# EAGLE design mega16-dev (EAGLE 5.07)
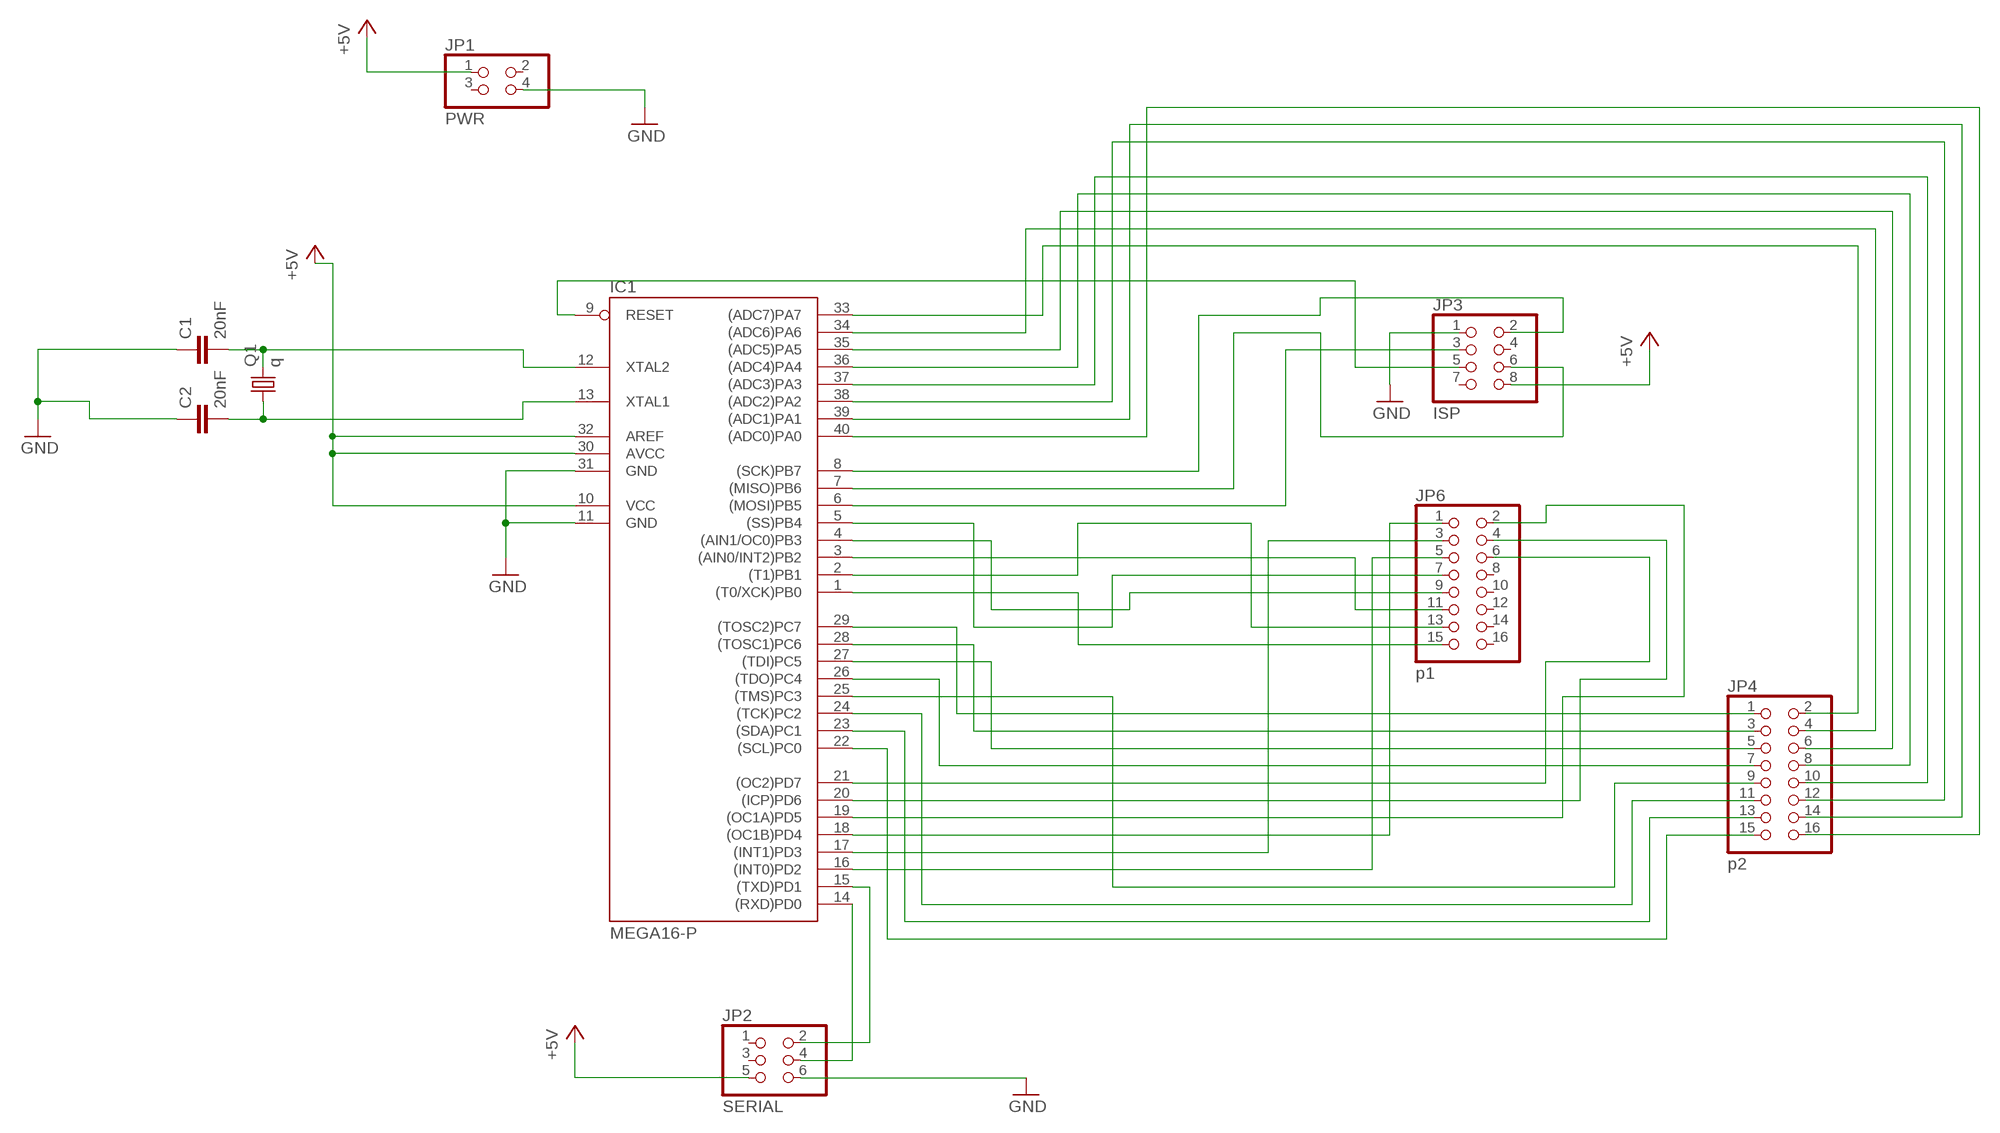
[diagram p0: schematic, sheet 1]

## Parts
C1  20nF  C-EU025-030X050  [C025-030X050]
C2  20nF  C-EU025-030X050  [C025-030X050]
IC1  MEGA16-P  [DIL40]
JP1  PWR  PINHD-2X2  [2X02]
JP2  SERIAL  PINHD-2X3  [2X03]
JP3  ISP  PINHD-2X4  [2X04]
JP4  p2  PINHD-2X8  [2X08]
JP6  p1  PINHD-2X8  [2X08]
Q1  q  CRYSTALHC18U-V  [HC18U-V]

## Nets
+5V: IC1.10(VCC) IC1.30(AVCC) IC1.32(AREF) JP1.1 JP2.5 JP3.8
GND: C1.1 C2.1 IC1.11(GND) IC1.31(GND) JP1.4 JP2.6 JP3.1
N$1: C1.2 IC1.12(XTAL2) Q1.2
N$2: C2.2 IC1.13(XTAL1) Q1.1
N$3: IC1.15((TXD)PD1) JP2.2
N$4: IC1.6((MOSI)PB5) JP3.3
N$5: IC1.14((RXD)PD0) JP2.4
N$6: IC1.9(RESET) JP3.5
N$7: IC1.8((SCK)PB7) JP3.2
N$8: IC1.7((MISO)PB6) JP3.6
N$9: IC1.18((OC1B)PD4) JP6.1
N$10: IC1.17((INT1)PD3) JP6.3
N$11: IC1.16((INT0)PD2) JP6.5
N$12: IC1.4((AIN1/OC0)PB3) JP6.9
N$13: IC1.5((SS)PB4) JP6.7
N$14: IC1.3((AIN0/INT2)PB2) JP6.11
N$15: IC1.2((T1)PB1) JP6.13
N$16: IC1.1((T0/XCK)PB0) JP6.15
N$17: IC1.19((OC1A)PD5) JP6.2
N$18: IC1.20((ICP)PD6) JP6.4
N$19: IC1.21((OC2)PD7) JP6.6
N$20: IC1.33((ADC7)PA7) JP4.2
N$21: IC1.34((ADC6)PA6) JP4.4
N$22: IC1.35((ADC5)PA5) JP4.6
N$23: IC1.36((ADC4)PA4) JP4.8
N$24: IC1.37((ADC3)PA3) JP4.10
N$25: IC1.38((ADC2)PA2) JP4.12
N$26: IC1.39((ADC1)PA1) JP4.14
N$27: IC1.40((ADC0)PA0) JP4.16
N$28: IC1.29((TOSC2)PC7) JP4.1
N$29: IC1.28((TOSC1)PC6) JP4.3
N$30: IC1.27((TDI)PC5) JP4.5
N$31: IC1.26((TDO)PC4) JP4.7
N$32: IC1.25((TMS)PC3) JP4.9
N$33: IC1.24((TCK)PC2) JP4.11
N$34: IC1.23((SDA)PC1) JP4.13
N$35: IC1.22((SCL)PC0) JP4.15
Unconnected: JP1.2 JP1.3 JP2.1 JP2.3 JP3.4 JP3.7 JP6.8 JP6.10 JP6.12 JP6.14 JP6.16

## Library data of the parts
C1 C2 = rcl:C-EU: CAPACITOR, European symbol
IC1 = atmel:MEGA16-P: MICROCONTROLLER 16 Kbytes FLASH 1 kbytes SRAM 512 bytes EEPROM USART 8-channel 10 bit ADC Source: avr.lbr
JP1 = pinhead:PINHD-2X2: PIN HEADER
JP2 = pinhead:PINHD-2X3: PIN HEADER
JP3 = pinhead:PINHD-2X4: PIN HEADER
JP4 JP6 = pinhead:PINHD-2X8: PIN HEADER
Q1 = crystal:CRYSTAL: CRYSTAL

## Board
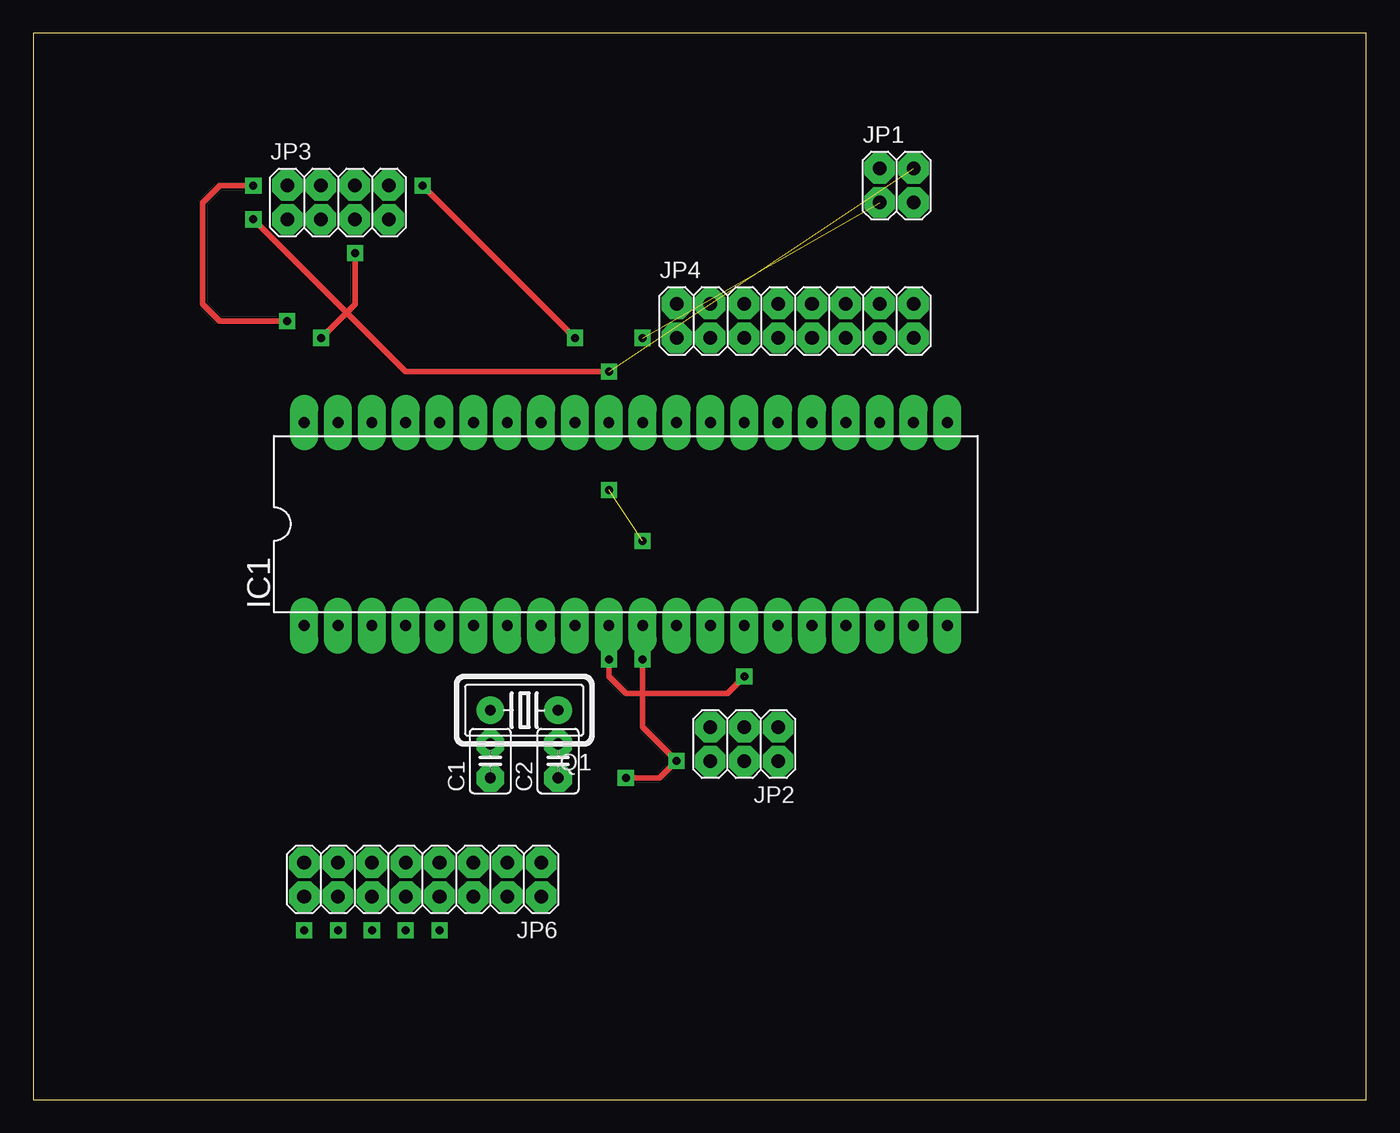
[diagram p1: board, top side]
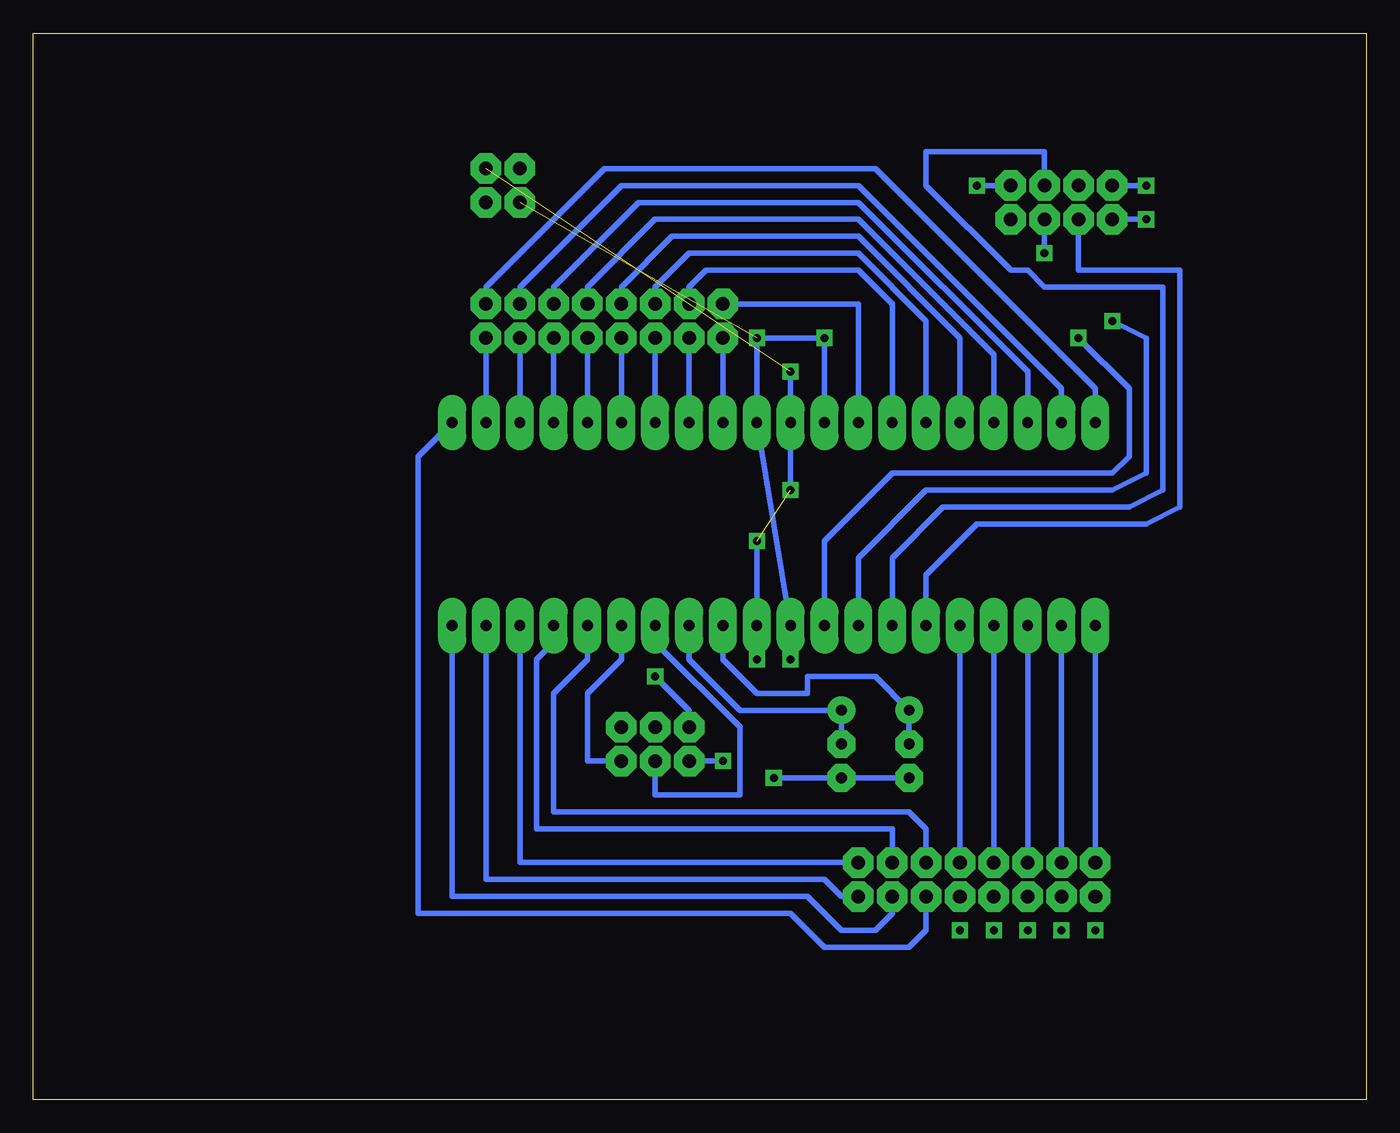
[diagram p2: board, bottom side, seen from below]

Size 100 x 80 mm. Coordinates in mm from the lower left corner, seen from the top.
Outline: 0,0 100,0 100,80 0,80 0,0
Copper layers (1*16): Top 0.035mm / dielectric 1.5mm / Bottom 0.035mm
Design rules "default": minimum track width 10mil, minimum drill 32mil, track to track 12mil, track to pad 12mil, pad to pad 12mil, via to via 12mil, smd to smd 8mil, copper to edge 40mil, drill to drill 40mil, minimum pad ring 25mil, minimum via ring 12mil, stop-mask expansion 4mil, vias tented up to drill 0mil, thermal gap 10mil

### Footprints (pad centres in the part's own frame; a part is rotated, then mirrored left to right if it is on the bottom)
C025-030X050 = drill 0.813 octagon: 1 -1.27,0; 2 1.27,0
DIL40 = drill 0.813 long: 1 -24.13,-7.62; 2 -21.59,-7.62; 3 -19.05,-7.62; 4 -16.51,-7.62; 5 -13.97,-7.62; 6 -11.43,-7.62; 7 -8.89,-7.62; 8 -6.35,-7.62; 9 -3.81,-7.62; 10 -1.27,-7.62; 11 1.27,-7.62; 12 3.81,-7.62; 13 6.35,-7.62; 14 8.89,-7.62; 15 11.43,-7.62; 16 13.97,-7.62; 17 16.51,-7.62; 18 19.05,-7.62; 19 21.59,-7.62; 20 24.13,-7.62; 21 24.13,7.62; 22 21.59,7.62; 23 19.05,7.62; 24 16.51,7.62; 25 13.97,7.62; 26 11.43,7.62; 27 8.89,7.62; 28 6.35,7.62; 29 3.81,7.62; 30 1.27,7.62; 31 -1.27,7.62; 32 -3.81,7.62; 33 -6.35,7.62; 34 -8.89,7.62; 35 -11.43,7.62; 36 -13.97,7.62; 37 -16.51,7.62; 38 -19.05,7.62; 39 -21.59,7.62; 40 -24.13,7.62
2X02 = drill 1.016 octagon: 1 -1.27,-1.27; 2 -1.27,1.27; 3 1.27,-1.27; 4 1.27,1.27
2X03 = drill 1.016 octagon: 1 -2.54,-1.27; 2 -2.54,1.27; 3 0,-1.27; 4 0,1.27; 5 2.54,-1.27; 6 2.54,1.27
2X04 = drill 1.016 octagon: 1 -3.81,-1.27; 2 -3.81,1.27; 3 -1.27,-1.27; 4 -1.27,1.27; 5 1.27,-1.27; 6 1.27,1.27; 7 3.81,-1.27; 8 3.81,1.27
2X08 = drill 1.016 octagon: 1 -8.89,-1.27; 2 -8.89,1.27; 3 -6.35,-1.27; 4 -6.35,1.27; 5 -3.81,-1.27; 6 -3.81,1.27; 7 -1.27,-1.27; 8 -1.27,1.27; 9 1.27,-1.27; 10 1.27,1.27; 11 3.81,-1.27; 12 3.81,1.27; 13 6.35,-1.27; 14 6.35,1.27; 15 8.89,-1.27; 16 8.89,1.27
HC18U-V = drill 0.813 round: 1 -2.54,0; 2 2.54,0

### Placement (x,y rotation side)
C1  34.29,25.4 90 top
C2  39.37,25.4 90 top
IC1  44.45,43.18 0 top
JP1  64.77,68.58 0 top
JP2  53.34,26.67 180 top
JP3  22.86,67.31 0 top
JP4  57.15,58.42 0 top
JP6  29.21,16.51 180 top
Q1  36.83,29.21 180 top

### Tracks (layer width: path | path; a pad name or v marks a point on that pad's centre or on a via)
+5V  (via drill 0.6)  (3 unrouted)
  Top 0.406: v29.21,68.58 40.64,57.15 | v43.18,33.02 43.18,31.75 44.45,30.48 52.07,30.48 53.34,31.75
  Bottom 0.406: IC1.32 40.64,57.15 45.72,57.15 IC1.30 IC1.10 v43.18,33.02 | JP3.8 v29.21,68.58 | JP2.5 50.8,29.21 53.34,31.75
GND  (via drill 0.6)  (4 unrouted)
  Top 0.406: v43.18,54.61 27.94,54.61 16.51,66.04 | v44.45,24.13 46.99,24.13 48.26,25.4 45.72,27.94 v45.72,33.02
  Bottom 0.406: v43.18,54.61 IC1.31 43.18,45.72 | 16.51,66.04 JP3.1 | C1.1 C2.1 v44.45,24.13 | 48.26,25.4 JP2.6 | 45.72,41.91 IC1.11 v45.72,33.02
N$1
  Bottom 0.406: C1.2 Q1.2 36.83,31.75 41.91,31.75 41.91,30.48 45.72,30.48 48.26,33.02 IC1.12
N$2
  Bottom 0.406: IC1.13 50.8,33.02 46.99,29.21 Q1.1 C2.2
N$3
  Bottom 0.406: IC1.15 55.88,33.02 58.42,30.48 58.42,25.4 JP2.2
N$4
  Bottom 0.406: IC1.6 33.02,39.37 29.21,43.18 16.51,43.18 13.97,44.45 13.97,62.23 21.59,62.23 JP3.3
N$5
  Bottom 0.406: IC1.14 53.34,34.29 46.99,27.94 46.99,22.86 53.34,22.86 JP2.4
N$6  (via drill 0.6)  (1 unrouted)
  Top 0.406: v21.59,57.15 24.13,59.69 24.13,63.5
  Bottom 0.406: 24.13,63.5 JP3.5 | IC1.9 40.64,41.91 35.56,46.99 19.05,46.99 17.78,48.26 17.78,53.34 v21.59,57.15
N$7  (via drill 0.6)  (1 unrouted)
  Top 0.406: v19.05,58.42 13.97,58.42 12.7,59.69 12.7,67.31 13.97,68.58 16.51,68.58
  Bottom 0.406: IC1.8 38.1,40.64 33.02,45.72 19.05,45.72 16.51,46.99 16.51,57.15 v19.05,58.42 | 16.51,68.58 JP3.2
N$8
  Bottom 0.406: IC1.7 35.56,40.64 31.75,44.45 17.78,44.45 15.24,45.72 15.24,60.96 24.13,60.96 25.4,62.23 26.67,62.23 33.02,68.58 33.02,71.12 24.13,71.12 JP3.6
N$9
  Bottom 0.406: JP6.1 63.5,17.78 IC1.18
N$10
  Bottom 0.406: IC1.17 60.96,34.29 62.23,33.02 62.23,20.32 35.56,20.32 JP6.3
N$11
  Bottom 0.406: JP6.5 33.02,20.32 34.29,21.59 60.96,21.59 60.96,30.48 58.42,33.02 IC1.16
N$12
  Bottom 0.406: JP6.9 IC1.4
N$13
  Bottom 0.406: JP6.7 IC1.5
N$14
  Bottom 0.406: JP6.11 IC1.3
N$15
  Bottom 0.406: JP6.13 IC1.2
N$16
  Bottom 0.406: JP6.15 IC1.1
N$17
  Bottom 0.406: JP6.2 39.37,15.24 40.64,16.51 66.04,16.51 IC1.19
N$18
  Bottom 0.406: JP6.4 35.56,13.97 36.83,12.7 39.37,12.7 41.91,15.24 68.58,15.24 IC1.20
N$19
  Bottom 0.406: JP6.6 33.02,12.7 34.29,11.43 40.64,11.43 43.18,13.97 71.12,13.97 71.12,48.26 IC1.21
N$20
  Bottom 0.406: IC1.33 38.1,59.69 JP4.2
N$21
  Bottom 0.406: IC1.34 35.56,59.69 38.1,62.23 49.53,62.23 50.8,60.96 JP4.4
N$22
  Bottom 0.406: IC1.35 33.02,58.42 38.1,63.5 50.8,63.5 53.34,60.96 JP4.6
N$23
  Bottom 0.406: IC1.36 30.48,57.15 38.1,64.77 52.07,64.77 55.88,60.96 JP4.8
N$24
  Bottom 0.406: IC1.37 27.94,55.88 38.1,66.04 53.34,66.04 58.42,60.96 JP4.10
N$25
  Bottom 0.406: IC1.38 25.4,54.61 38.1,67.31 54.61,67.31 60.96,60.96 JP4.12
N$26
  Bottom 0.406: IC1.39 22.86,53.34 38.1,68.58 55.88,68.58 63.5,60.96 JP4.14
N$27
  Bottom 0.406: IC1.40 20.32,53.34 36.83,69.85 57.15,69.85 66.04,60.96 JP4.16
N$28
  Bottom 0.406: IC1.29 JP4.1
N$29
  Bottom 0.406: IC1.28 JP4.3
N$30
  Bottom 0.406: IC1.27 JP4.5
N$31
  Bottom 0.406: IC1.26 JP4.7
N$32
  Bottom 0.406: IC1.25 JP4.9
N$33
  Bottom 0.406: IC1.24 JP4.11
N$34
  Bottom 0.406: IC1.23 JP4.13
N$35
  Bottom 0.406: IC1.22 JP4.15
N$36  (via drill 0.6)
  other vias: 40.64,57.15
N$37  (via drill 0.6)
  other vias: 45.72,57.15
N$38  (via drill 0.6)
  other vias: 43.18,54.61
N$39  (via drill 0.6)
  other vias: 48.26,25.4
N$40  (via drill 0.6)
  other vias: 53.34,31.75
N$41  (via drill 0.6)
  other vias: 44.45,24.13
N$42  (via drill 0.6)
  other vias: 16.51,66.04
N$43  (via drill 0.6)
  other vias: 16.51,68.58
N$44  (via drill 0.6)
  other vias: 29.21,68.58
N$45  (via drill 0.6)
  other vias: 24.13,63.5
N$46  (via drill 0.6)
  other vias: 20.32,12.7
N$47  (via drill 0.6)
  other vias: 22.86,12.7
N$48  (via drill 0.6)
  other vias: 25.4,12.7
N$49  (via drill 0.6)
  other vias: 27.94,12.7
N$50  (via drill 0.6)
  other vias: 30.48,12.7
N$51  (via drill 0.6)
  other vias: 43.18,45.72
N$52  (via drill 0.6)
  other vias: 45.72,41.91
N$53  (via drill 0.6)
  other vias: 45.72,33.02
N$54  (via drill 0.6)
  other vias: 43.18,33.02